# Altium schematic sheet drv.SchDoc
size A2
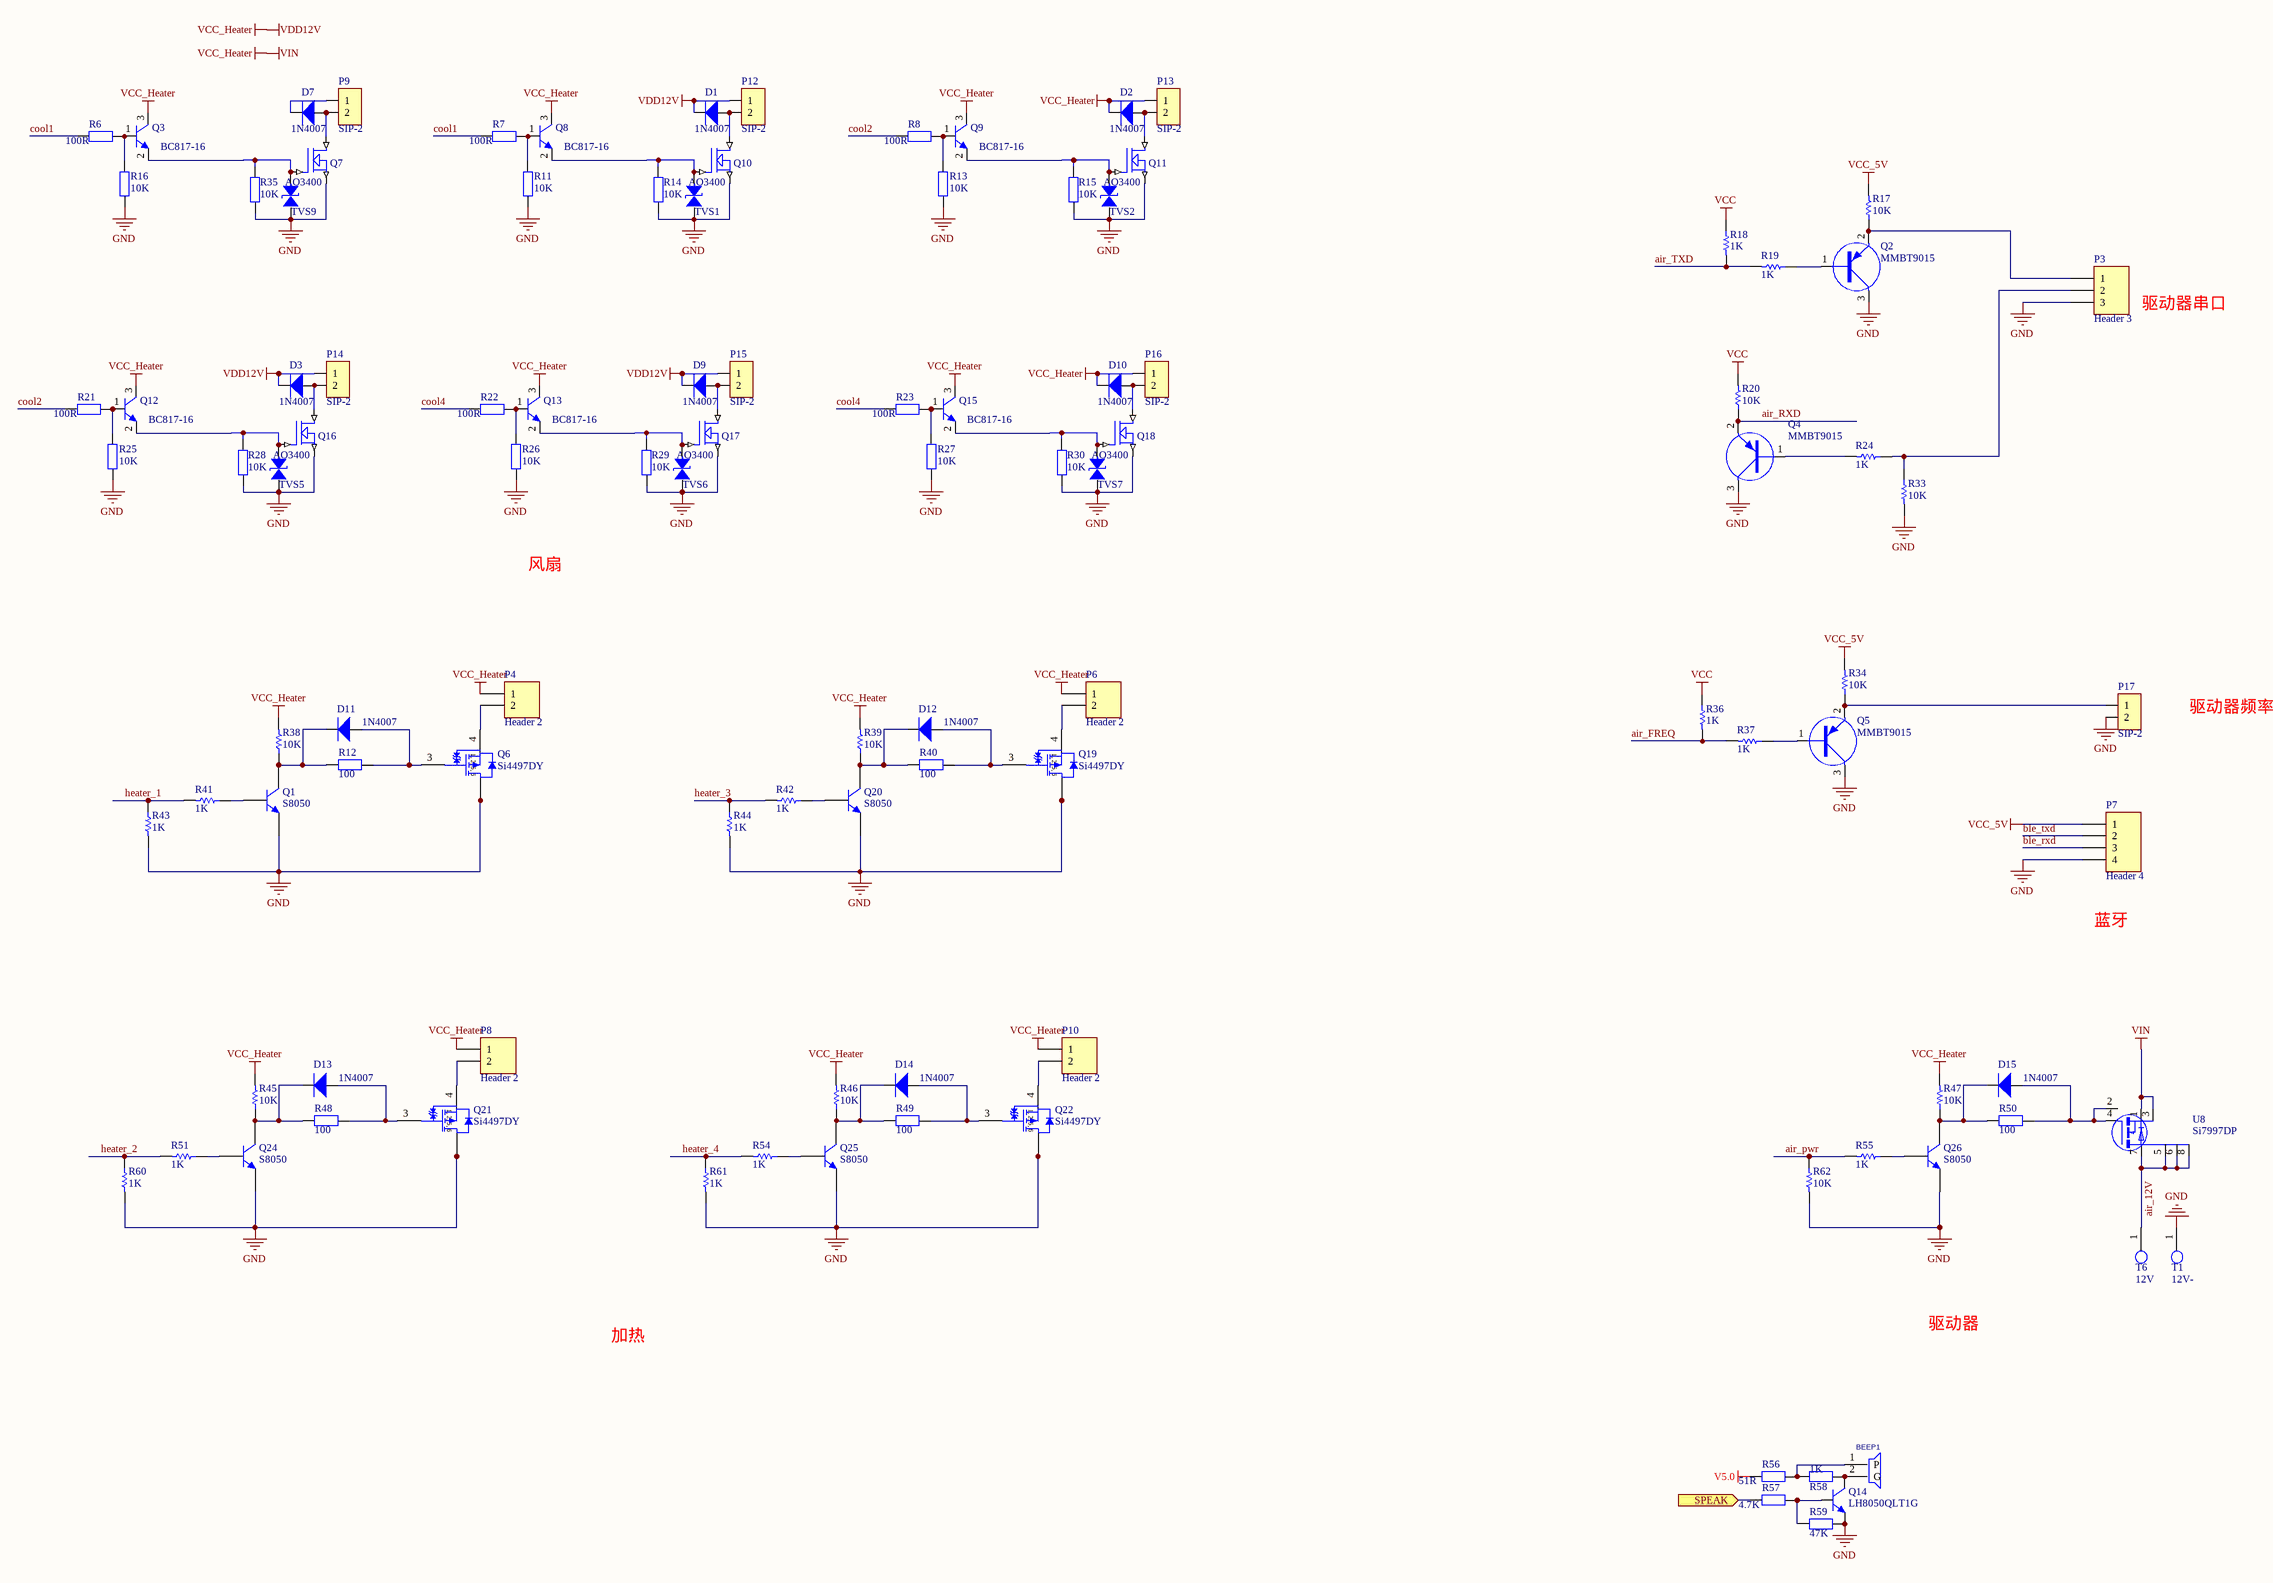
[diagram p0: drv.SchDoc]

## Parts
BEEP1  BEEP-9.5X5.5  [BEEP-9.5X5.5]  (value not drawn)
D1  1N4007  [DO-214-AC]
D2  1N4007  [DO-214-AC]
D3  1N4007  [DO-214-AC]
D7  1N4007  [DO-214-AC]
D9  1N4007  [DO-214-AC]
D10  1N4007  [DO-214-AC]
D11  1N4007  [DO-214-AC]
D12  1N4007  [DO-214-AC]
D13  1N4007  [DO-214-AC]
D14  1N4007  [DO-214-AC]
D15  1N4007  [DO-214-AC]
P3  Header 3  [HDR1X3]
P4  Header 2  [HDR1X2]
P6  Header 2  [HDR1X2]
P7  Header 4  [HDR1X4]
P8  Header 2  [HDR1X2]
P9  SIP-2  [SIP-2A]
P10  Header 2  [HDR1X2]
P12  SIP-2  [SIP-2A]
P13  SIP-2  [SIP-2A]
P14  SIP-2  [SIP-2A]
P15  SIP-2  [SIP-2A]
P16  SIP-2  [SIP-2A]
P17  SIP-2  [SIP-2A]
Q1  S8050  [SOT23-3]
Q2  MMBT9015  [SOT23-3]
Q3  BC817-16  [SOT-23]
Q4  MMBT9015  [SOT23-3]
Q5  MMBT9015  [SOT23-3]
Q6  Si4497DY
Q7  AO3400  [SOT-23]
Q8  BC817-16  [SOT-23]
Q9  BC817-16  [SOT-23]
Q10  AO3400  [SOT-23]
Q11  AO3400  [SOT-23]
Q12  BC817-16  [SOT-23]
Q13  BC817-16  [SOT-23]
Q14  LH8050QLT1G  [SOT-23]
Q15  BC817-16  [SOT-23]
Q16  AO3400  [SOT-23]
Q17  AO3400  [SOT-23]
Q18  AO3400  [SOT-23]
Q19  Si4497DY
Q20  S8050  [SOT23-3]
Q21  Si4497DY
Q22  Si4497DY
Q24  S8050  [SOT23-3]
Q25  S8050  [SOT23-3]
Q26  S8050  [SOT23-3]
R6  100R  [0603R]
R7  100R  [0603R]
R8  100R  [0603R]
R11  10K  [0603R]
R12  100  [0603R]
R13  10K  [0603R]
R14  10K  [0603R]
R15  10K  [0603R]
R16  10K  [0603R]
R17  10K  [0603R]
R18  1K  [0603R]
R19  1K  [0603R]
R20  10K  [0603R]
R21  100R  [0603R]
R22  100R  [0603R]
R23  100R  [0603R]
R24  1K  [0603R]
R25  10K  [0603R]
R26  10K  [0603R]
R27  10K  [0603R]
R28  10K  [0603R]
R29  10K  [0603R]
R30  10K  [0603R]
R33  10K  [0603R]
R34  10K  [0603R]
R35  10K  [0603R]
R36  1K  [0603R]
R37  1K  [0603R]
R38  10K  [0603R]
R39  10K  [0603R]
R40  100  [0603R]
R41  1K  [0603R]
R42  1K  [0603R]
R43  1K  [0603R]
R44  1K  [0603R]
R45  10K  [0603R]
R46  10K  [0603R]
R47  10K  [0603R]
R48  100  [0603R]
R49  100  [0603R]
R50  100  [0603R]
R51  1K  [0603R]
R54  1K  [0603R]
R55  1K  [0603R]
R56  51R  [0603R]
R57  4.7K  [0603R]
R58  1K  [0603R]
R59  47K  [0603R]
R60  1K  [0603R]
R61  1K  [0603R]
R62  10K  [0603R]
T1  12V-  [FIX-4.5]
T6  12V  [FIX-4.5]
TVS1  ESD5Z5.0CT1G  [SOD-523]  (value not drawn)
TVS2  ESD5Z5.0CT1G  [SOD-523]  (value not drawn)
TVS5  ESD5Z5.0CT1G  [SOD-523]  (value not drawn)
TVS6  ESD5Z5.0CT1G  [SOD-523]  (value not drawn)
TVS7  ESD5Z5.0CT1G  [SOD-523]  (value not drawn)
TVS9  ESD5Z5.0CT1G  [SOD-523]  (value not drawn)
U8  Si7997DP  [SC-70(PowerPAK)]

## Ports
SPEAK (in)

## Nets
GND: P3.3 P7.4 P17.2 Q1.2(E) Q2.3(C) Q4.3(C) Q5.3(C) Q6.1(D) Q6.2(D) Q6.5(D) Q6.6(D) Q7.2(S) Q10.2(S) Q11.2(S) Q14.2(E) Q16.2(S) Q17.2(S) Q18.2(S) Q19.1(D) Q19.2(D) Q19.5(D) Q19.6(D) Q20.2(E) Q21.1(D) Q21.2(D) Q21.5(D) Q21.6(D) Q22.1(D) Q22.2(D) Q22.5(D) Q22.6(D) Q24.2(E) Q25.2(E) Q26.2(E) R11.1 R13.1 R14.2 R15.2 R16.1 R25.1 R26.1 R27.1 R28.2 R29.2 R30.2 R33.2 R35.2 R43.2 R44.2 R59.2 R60.2 R61.2 R62.2 T1.1 TVS1.1(A) TVS2.1(A) TVS5.1(A) TVS6.1(A) TVS7.1(A) TVS9.1(A)
V5.0: R56.2
VCC: R18.1 R20.2 R36.1
VCC_5V: P7.1 R17.2 R34.2
VCC_Heater: D1.2(K) D2.2(K) D3.2(K) D9.2(K) D10.2(K) P4.1 P6.1 P8.1 P10.1 P12.1 P13.1 P14.1 P15.1 P16.1 Q3.3(C) Q8.3(C) Q9.3(C) Q12.3(C) Q13.3(C) Q15.3(C) R38.2 R39.2 R45.2 R46.2 R47.2 U8.1(S) U8.3(S)  [also labelled VDD12V, VIN]
air_12V: T6.1 U8.5(D) U8.6(D) U8.7(D) U8.8(D)
air_FREQ: R36.2 R37.2
air_pwr: R55.2 R62.1
air_RXD: Q4.2(E) R20.1
air_TXD: R18.2 R19.2
ble_rxd: P7.3
ble_txd: P7.2
cool1: R6.2 R7.2
cool2: R8.2 R21.2
cool4: R22.2 R23.2
heater_1: R41.2 R43.1
heater_2: R51.2 R60.1
heater_3: R42.2 R44.1
heater_4: R54.2 R61.1
SPEAK: R57.1 ; port SPEAK
NetBEEP1_1: BEEP1.1(P) R56.1 R58.2
NetBEEP1_2: BEEP1.2(G) Q14.3(C) R58.1
NetD1_1: D1.1(A) P12.2 Q10.3(D)
NetD2_1: D2.1(A) P13.2 Q11.3(D)
NetD3_1: D3.1(A) P14.2 Q16.3(D)
NetD7_1: D7.1(A) P9.2 Q7.3(D)
NetD7_2: D7.2(K) P9.1
NetD9_1: D9.1(A) P15.2 Q17.3(D)
NetD10_1: D10.1(A) P16.2 Q18.3(D)
NetD11_1: D11.1(A) Q6.3(G) R12.2
NetD11_2: D11.2(K) Q1.3(C) R12.1 R38.1
NetD12_1: D12.1(A) Q19.3(G) R40.2
NetD12_2: D12.2(K) Q20.3(C) R39.1 R40.1
NetD13_1: D13.1(A) Q21.3(G) R48.2
NetD13_2: D13.2(K) Q24.3(C) R45.1 R48.1
NetD14_1: D14.1(A) Q22.3(G) R49.2
NetD14_2: D14.2(K) Q25.3(C) R46.1 R49.1
NetD15_1: D15.1(A) R50.2 U8.2(G) U8.4(G)
NetD15_2: D15.2(K) Q26.3(C) R47.1 R50.1
NetP3_1: P3.1 Q2.2(E) R17.1
NetP3_2: P3.2 R24.1 R33.1
NetP4_2: P4.2 Q6.4(S)
NetP6_2: P6.2 Q19.4(S)
NetP8_2: P8.2 Q21.4(S)
NetP10_2: P10.2 Q22.4(S)
NetP17_1: P17.1 Q5.2(E) R34.1
NetQ1_1: Q1.1(B) R41.1
NetQ2_1: Q2.1(B) R19.1
NetQ3_1: Q3.1(B) R6.1 R16.2
NetQ3_2: Q3.2(E) Q7.1(G) R35.1 TVS9.2(B)
NetQ4_1: Q4.1(B) R24.2
NetQ5_1: Q5.1(B) R37.1
NetQ8_1: Q8.1(B) R7.1 R11.2
NetQ8_2: Q8.2(E) Q10.1(G) R14.1 TVS1.2(B)
NetQ9_1: Q9.1(B) R8.1 R13.2
NetQ9_2: Q9.2(E) Q11.1(G) R15.1 TVS2.2(B)
NetQ12_1: Q12.1(B) R21.1 R25.2
NetQ12_2: Q12.2(E) Q16.1(G) R28.1 TVS5.2(B)
NetQ13_1: Q13.1(B) R22.1 R26.2
NetQ13_2: Q13.2(E) Q17.1(G) R29.1 TVS6.2(B)
NetQ14_1: Q14.1(B) R57.2 R59.1
NetQ15_1: Q15.1(B) R23.1 R27.2
NetQ15_2: Q15.2(E) Q18.1(G) R30.1 TVS7.2(B)
NetQ20_1: Q20.1(B) R42.1
NetQ24_1: Q24.1(B) R51.1
NetQ25_1: Q25.1(B) R54.1
NetQ26_1: Q26.1(B) R55.1

## Notes on the sheet
- 驱动器串口
- 风扇
- 驱动器频率控制
- 蓝牙
- 加热
- 驱动器
- (in symbol SQ3419AEEV-T1_GE3) 1, 2, 5, 6

## Library data of the parts
D1-D3 D7 D9-D15 = DIODE2: 贴片二极管
P3 = Header 3: Header, 3-Pin; LatestRevisionDate: 17-Jul-2002; LatestRevisionNote: Re-released for DXP Platform.; Publisher: Altium Limited
P4 P6 P8 P10 = Header 2: Header, 2-Pin; LatestRevisionDate: 17-Jul-2002; LatestRevisionNote: Re-released for DXP Platform.; Publisher: Altium Limited
P7 = Header 4: Header, 4-Pin; LatestRevisionDate: 17-Jul-2002; LatestRevisionNote: Re-released for DXP Platform.; Publisher: Altium Limited
P9 P12-P17 = SIP-2: XH2.54 2P 立贴
Q1 Q20 Q24-Q26 = NPN: NPN Bipolar Transistor; Published: 8-Jun-2000; LatestRevisionDate: 17-Jul-2002; LatestRevisionNote: Re-released for DXP Platform.; PackageReference: TO-226; Publisher: Altium Limited; Code_JEDEC: TO-226-AA
Q2 Q4 Q5 = PNP
Q3 Q8 Q9 Q12 Q13 Q15 = NPN-1: 三极管
Q6 Q19 Q21 Q22 = SQ3419AEEV-T1_GE3: Automotive P-Channel MOSFET, 6.9 A, 40 V, -55 to 175 degC, 6-Pin TSOP, RoHS, Tape and Reel; Manufacturer: International Rectifier; Rated Power Dissipation: 2W; Qg Gate Charge: 25nC; Drain-to-Source Voltage [Vdss]: 40V; Drain-Source On Resistance-Max: 112mO; Channel Type: P-Channel; Package Description: 6-Pin Thin Small Outline Package, Body 3 x 1.65 mm, Pitch 1.00 mm; Datasheet URL: https://www.vishay.com/docs/65332/sq3419aeev.pdf; Mounting Technology: SurfaceMount; Package Reference: TSOP-6; Manufacturer URL: https://www.vishay.com/; Datasheet Version: 04/2010
Q7 Q10 Q11 Q16-Q18 = MOSFET N
Q14 = NPN-1: NPN
R6-R8 R11-R16 R21-R23 R25-R30 R35 R40 R48-R50 = RES-SOP: 贴片电阻 5%
R17-R20 R24 R33 R34 R36-R39 R41-R47 R51 R54 R55 R60-R62 = Res1: Resistor; Published: 8-Jun-2000; LatestRevisionDate: 17-Jul-2002; LatestRevisionNote: Re-released for DXP Platform.; PackageReference: AXIAL-0.3; Publisher: Altium Limited
R56-R59 = RES0: 贴片电阻 5%
T1 T6 = TP
TVS1 TVS2 TVS5-TVS7 TVS9 = TVS-1: TVS
U8 = Si7997DP: Sia430DJ
BEEP1 = BEEP-9.5X5.5: PCB DECAL: BEEP-9.5X5.5